# EAGLE design Grove - Differential Amplifier v1.2 (EAGLE 6.5.0)
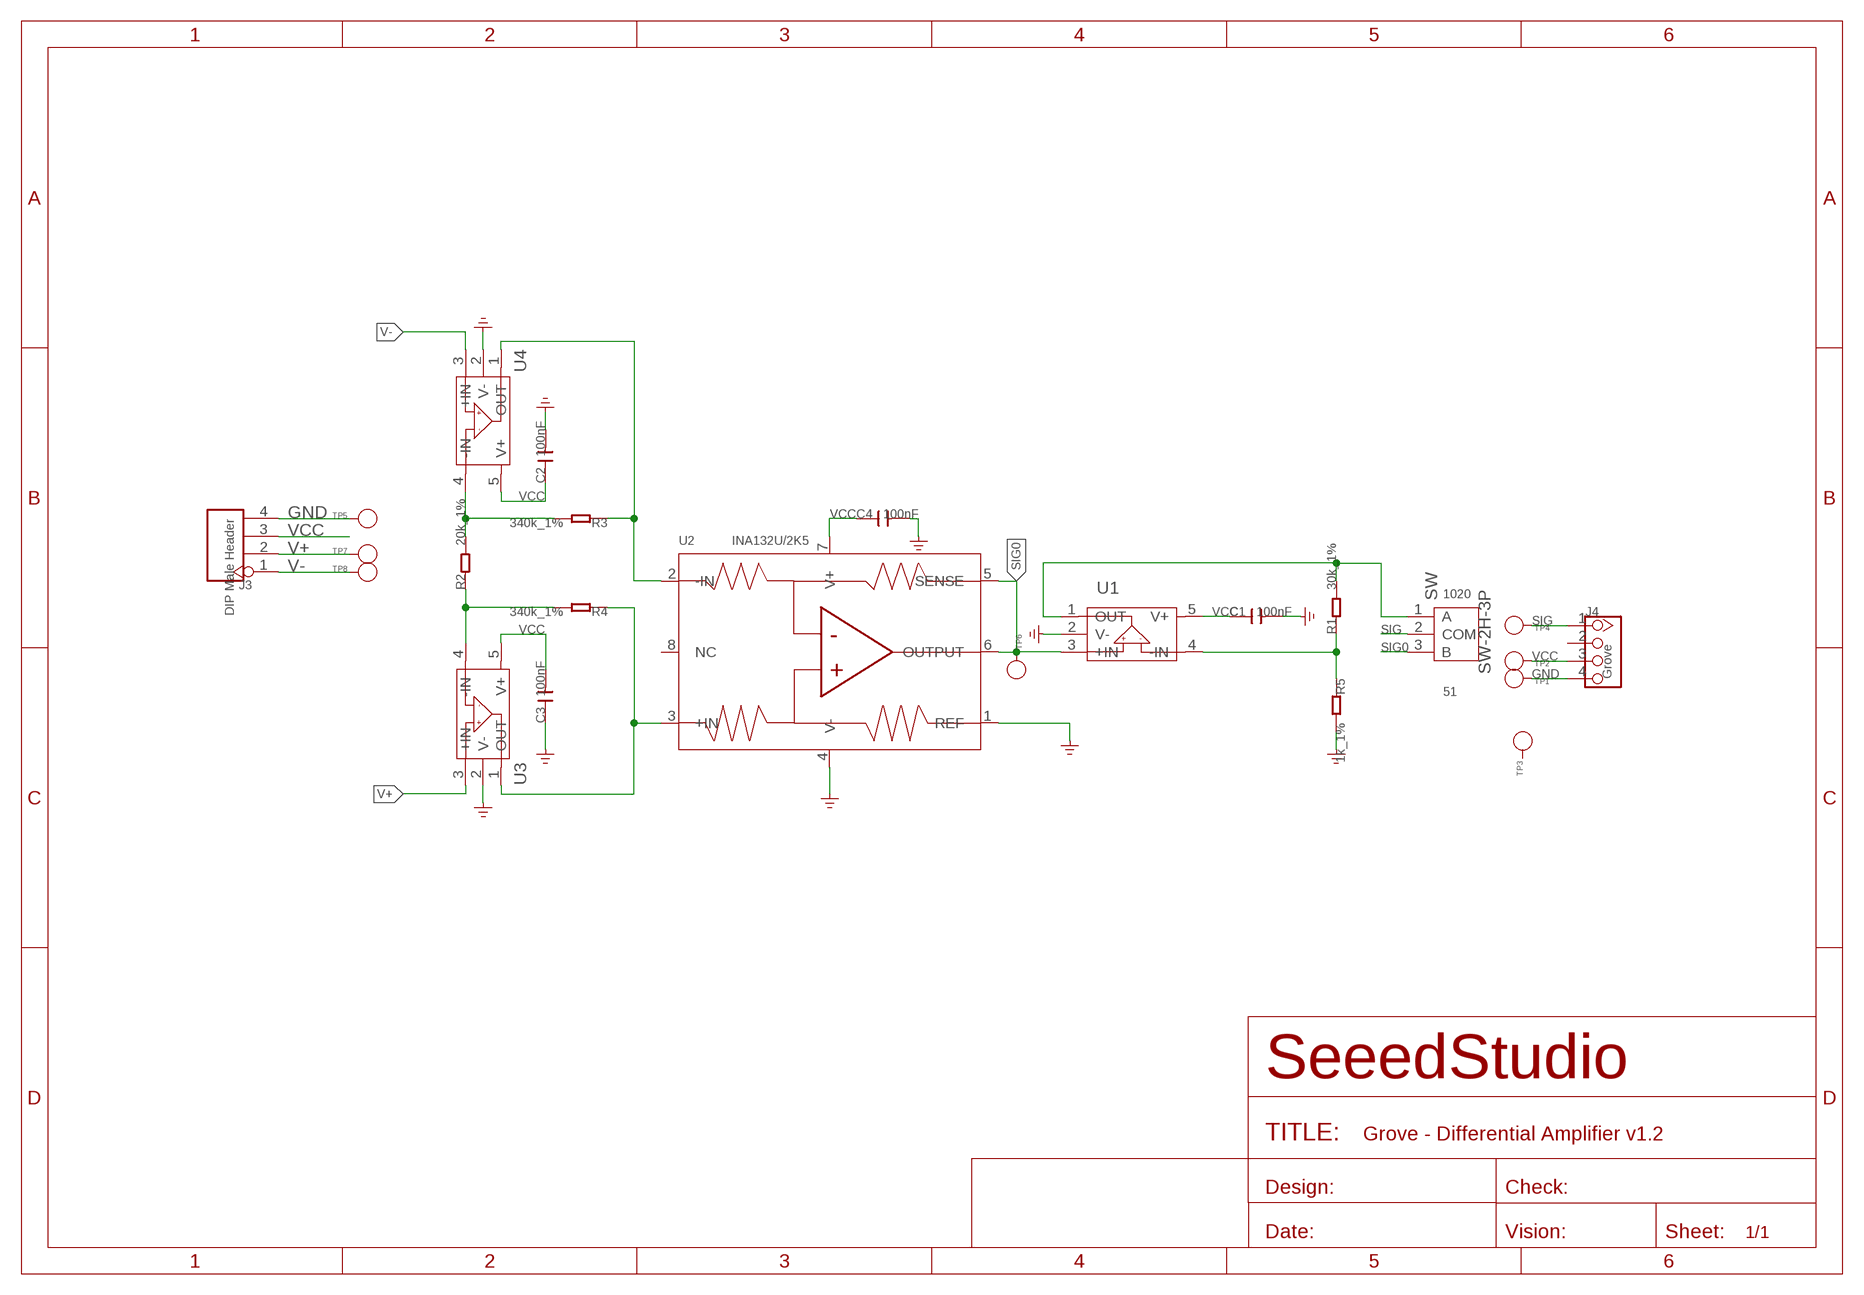
[diagram p0: schematic, sheet 1]

## Parts
C1  100nF  C-0603  [C0603]
C2  100nF  C-0603  [C0603]
C3  100nF  C-0603  [C0603]
C4  100nF  C-0603  [C0603]
J3  DIP Male Header  HEADER-4P-65/35MIL  [4P-65/35MIL]
J4  Grove  TWIG-4P-2.0-2.0  [4P-2.0]
R1  30k_1%  R-0603  [R0603]
R2  20k_1%  R-0603  [R0603]
R3  340k_1%  R-0603  [R0603]
R4  340k_1%  R-0603  [R0603]
R5  1k_1%  R-0603  [R0603]
SW  SW-2H-3P  SWITCH-2H-3P'--'  [3P-2CH-3.54X8.5]
TP1  PAD-TEST-POINT'4545'  [TP_4545]
TP2  PAD-TEST-POINT'4545'  [TP_4545]
TP3  PAD-TEST-POINT'4545'  [TP_4545]
TP4  PAD-TEST-POINT'4545'  [TP_4545]
TP5  PAD-TEST-POINT'4545'  [TP_4545]
TP6  PAD-TEST-POINT'4545'  [TP_4545]
TP7  PAD-TEST-POINT'4545'  [TP_4545]
TP8  PAD-TEST-POINT'4545'  [TP_4545]
U1  OPA333DBV  [SOT23-5]
U2  INA132U/2K5  [SOIC8-6.0]
U3  OPA333DBV  [SOT23-5]
U4  OPA333DBV  [SOT23-5]

## Nets
GND: C1.2 C2.2 C3.1 C4.2 J3.4 J4.4 R5.2 TP1.T TP5.T U1.2(V-) U2.1(REF) U2.4(V-) U3.2(V-) U4.2(V-)
N$1: R1.1 R5.1 U1.4(-IN)
N$2: R1.2 SW.1(A) U1.1(OUT)
N$7: R2.1 R4.2 U3.4(-IN)
N$8: R2.2 R3.2 U4.4(-IN)
N$9: R3.1 U2.2(-IN) U4.1(OUT)
N$10: R4.1 U2.3(+IN) U3.1(OUT)
SIG: J4.1 SW.2(COM) TP4.T
SIG0: SW.3(B) TP6.T U1.3(+IN) U2.5(SENSE) U2.6(OUTPUT)
V+: J3.2 TP7.T U3.3(+IN)
V-: J3.1 TP8.T U4.3(+IN)
VCC: C1.1 C2.1 C3.2 C4.1 J3.3 J4.3 TP2.T U1.5(V+) U2.7(V+) U3.5(V+) U4.5(V+)
Unconnected: J4.2 TP3.T U2.8(NC)

## Notes on the sheet
- 1020
- 51

## Library data of the parts
C1-C4 = Discrete:C*: Ceramic Capacitors
J3 = Connector:HEADER-4P
J4 = Connector:TWIG-4P-2.0
R1-R5 = Discrete:R*
SW = Discrete:SWITCH-2H-3P
TP1-TP8 = Discrete:PAD-TEST-POINT; PARTNO: DNP
U1 U3 U4 = IC:OPA333: 1.8V,Micro power CMOS oprational amplifiers Zero-Drift Series http://www.ti.com.cn/cn/lit/ds/symlink/opa333.pdf
U2 = template:INA132U/2K5: Low Power, Single-Supply DIFFERENCE AMPLIFIER

## Board
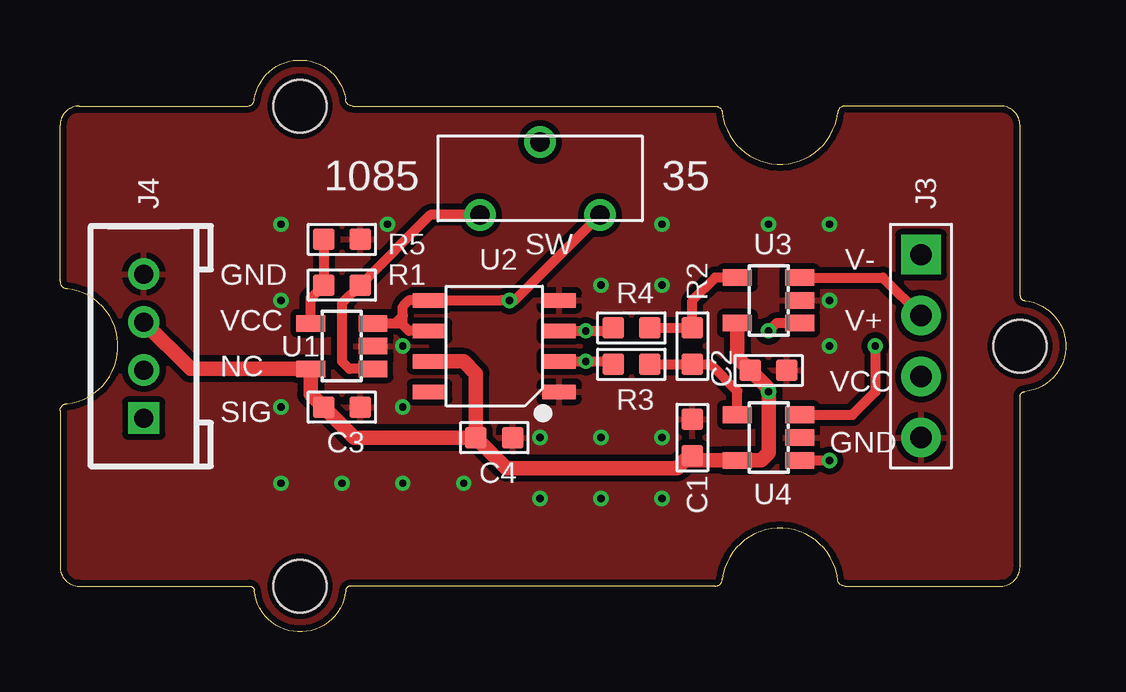
[diagram p1: board, top side]
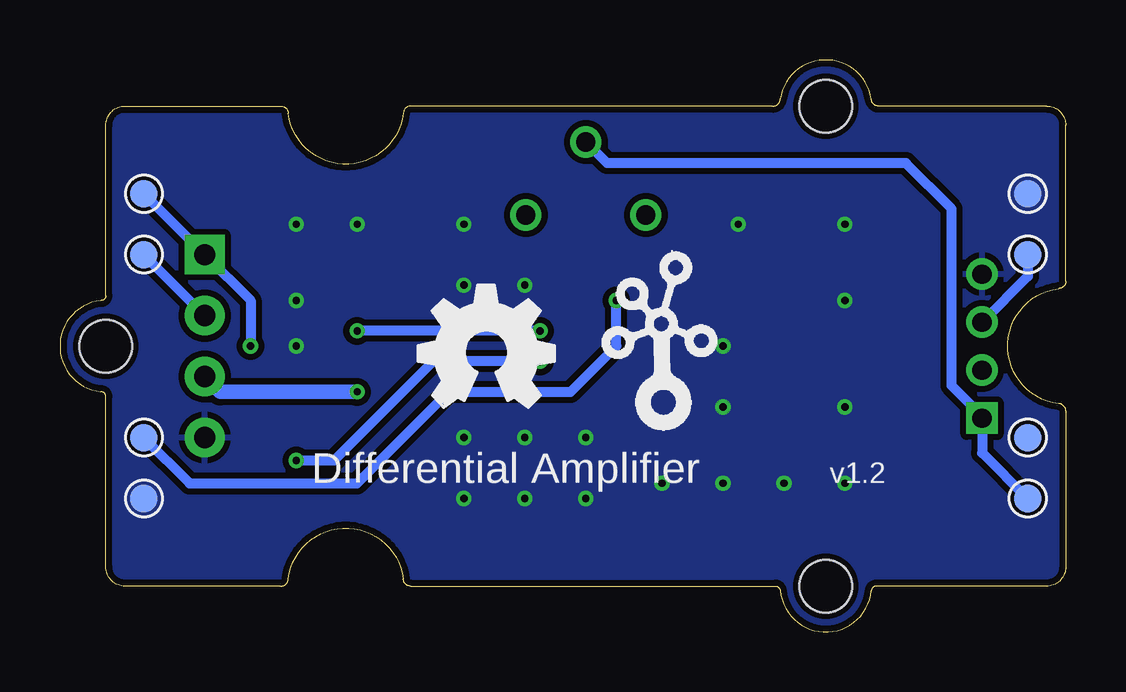
[diagram p2: board, bottom side, seen from below]

Size 41.91 x 23.83 mm. Coordinates in mm from the lower left corner, seen from the top.
Copper layers (1*16): Top 0.035mm / dielectric 1.5mm / Bottom 0.035mm
Design rules "SeeedStudio_2layer_DRU_no_angle_20140221 *": minimum track width 6mil, minimum drill 12mil, track to track 6mil, track to pad 6mil, pad to pad 6mil, via to via 6mil, smd to smd 0mil, copper to edge 10mil, drill to drill 10mil, minimum pad ring 10mil, minimum via ring 6mil, stop-mask expansion 2mil, vias tented up to drill 100mil, thermal gap 10mil

### Footprints (pad centres in the part's own frame; a part is rotated, then mirrored left to right if it is on the bottom)
C0603 = smd 0.889 x 0.889: 1 -0.762,0; 2 0.762,0
4P-65/35MIL = drill 0.889 pad 1.651 square: 1 0,3.81 | drill 0.889 pad 1.651: 2 0,1.27; 3 0,-1.27; 4 0,-3.81
4P-2.0 = drill 0.8 pad 1.27 square: 1 -3,0 | drill 0.8 pad 1.27: 2 -1,0; 3 1,0; 4 3,0
R0603 = smd 0.889 x 0.889: 1 -0.762,0; 2 0.762,0
3P-2CH-3.54X8.5 = drill 0.8 pad 1.3: 1 -2.5,-1.52; 2 0,1.52; 3 2.5,-1.52
TP_4545 = smd 1.143 x 1.143: T 0,0
SOT23-5 = smd 0.69 x 1.2: 1 -0.95,-1.3; 2 0,-1.3; 3 0.95,-1.3; 4 0.95,1.3; 5 -0.95,1.3
SOIC8-6.0 = smd 0.6 x 1.4: 1 -1.905,-2.7; 2 -0.635,-2.7; 3 0.635,-2.7; 4 1.905,-2.7; 5 1.905,2.7; 6 0.635,2.7; 7 -0.635,2.7; 8 -1.905,2.7
GROVE-TEST-PLATFORM = hole 2.2: -10,-10; -10,10; 20,0

### Placement (x,y rotation side)
C1  26.35,8.1 90 top
C2  29.52,10.89 0 top
C3  11.74,9.37 180 top
C4  18.09,8.1 0 top
J3  35.88,11.91 0 top
J4  3.49,11.91 90 top
R1  11.74,14.45 0 top
R2  26.35,11.91 270 top
R3  23.81,11.15 0 top
R4  23.81,12.67 0 top
R5  11.74,16.35 0 top
SW  20,18.89 0 top
TP1  1.59,18.26 0 bottom
TP2  1.59,15.72 0 bottom
TP3  1.59,8.1 0 bottom
TP4  1.59,5.56 0 bottom
TP5  38.41,5.56 0 bottom
TP6  38.41,8.1 0 bottom
TP7  38.41,15.72 0 bottom
TP8  38.41,18.26 0 bottom
U1  11.74,11.91 90 top
U2  18.09,11.91 90 top
U3  29.52,13.81 90 top
U4  29.52,8.1 90 top
U$13  [OSHW_FILLX200_NOTEXT]  26.98,9.37 0 bottom
U$14  [TWIGLOGO]  16.82,9.37 0 bottom
U$15  [GROVE-TEST-PLATFORM]  20,11.91 0 top

### Tracks (layer width: path | path; a pad name or v marks a point on that pad's centre or on a via)
GND  (via drill 0.3 pad 0.64)
  other vias: 14.29,11.91 13.65,16.99 14.29,9.37 20,8.1 25.08,8.1 32.06,13.81 32.06,11.91 22.54,14.45 25.08,14.45 22.54,8.1 14.29,6.19 16.82,6.19 11.74,6.19 9.21,6.19 9.21,9.37 9.21,16.99 9.21,13.81 32.06,16.99 25.08,16.99 29.52,16.99 25.08,5.56 22.54,5.56 20,5.56
  pour Top (isolate 0.254): -0.32,-0.16 42.23,-0.16 42.23,23.97 -0.32,23.97
  pour Bottom (isolate 0.254): -0.32,-0.16 42.23,-0.16 42.23,23.97 -0.32,23.97
N$1
  Top 0.406: R5.1 R1.1 10.45,13.91 U1.4
N$2
  Top 0.406: U1.1 12.06,10.96 11.74,11.27 11.74,13.69 R1.2 15.43,17.37 SW.1
N$7
  Top 0.406: R4.2 R2.1 26.35,13.81 27.3,14.76 U3.4
N$8
  Top 0.406: R3.2 R2.2 27.11,11.15 28.23,10.03 U4.4
N$9  (via drill 0.3 pad 0.64)
  Top 0.406: U2.2 v21.91,11.27 22.92,11.27 R3.1 | U4.1 v32.06,7.15
  Bottom 0.406: v21.91,11.27 26.35,11.27 30.48,7.15 v32.06,7.15
N$10  (via drill 0.3 pad 0.64)
  Top 0.406: U2.3 v21.91,12.54 22.92,12.54 R4.1 | U3.1 29.84,12.86 v29.52,12.54
  Bottom 0.406: v21.91,12.54 v29.52,12.54
SIG
  Bottom 0.406: TP4.T 3.49,7.46 J4.1 3.49,8.99 4.76,10.26 4.76,17.62 6.66,19.53 19.11,19.53 SW.2
SIG0  (via drill 0.3 pad 0.64)
  Top 0.406: U2.6 14.54,12.54 14.29,12.8 | 14.29,12.8 14.29,13.18 | 14.29,13.18 14.29,13.56 14.54,13.81 U2.5 18.35,13.81 v18.73,13.81 18.94,13.81 SW.3 | U1.3 13.96,12.86 | 13.96,12.86 14.22,12.86 14.29,12.8 | 13.96,12.86 14.29,13.18
  Bottom 0.406: TP6.T 36.51,6.19 29.52,6.19 25.71,10 20.64,10 18.73,11.91 v18.73,13.81
V+
  Top 0.406: U3.3 34.29,14.76 J3.2
  Bottom 0.406: J3.2 TP7.T
V-  (via drill 0.3 pad 0.64)
  Top 0.406: U4.3 33.02,9.05 33.97,10 v33.97,11.91
  Bottom 0.406: TP8.T J3.1 33.97,13.81 v33.97,11.91
VCC  (via drill 0.3 pad 0.64)
  Top 0.61: J4.3 5.44,10.96 U1.5 10.45,9.91 C3.2 12.25,8.1 C4.1 | C4.1 17.33,10.77 16.82,11.27 U2.7 | C1.1 26.22,7.34 26.04,7.15 | 26.04,7.15 25.71,6.83 18.6,6.83 C4.1 | 26.04,7.15 U4.5 29.21,7.15 29.52,7.46 v29.52,10 29.52,10.13 C2.1 28.23,11.43 U3.5
  Bottom 0.406: TP2.T 1.59,14.81 J4.3
  Bottom 0.61: v29.52,10 35.24,10 J3.3

### Text on the board
tPlace: GND | V- | VCC | V+ | NC | VCC | SIG | GND
bPlace: v1.2 | Differential Amplifier
tNames: 1085 | 35